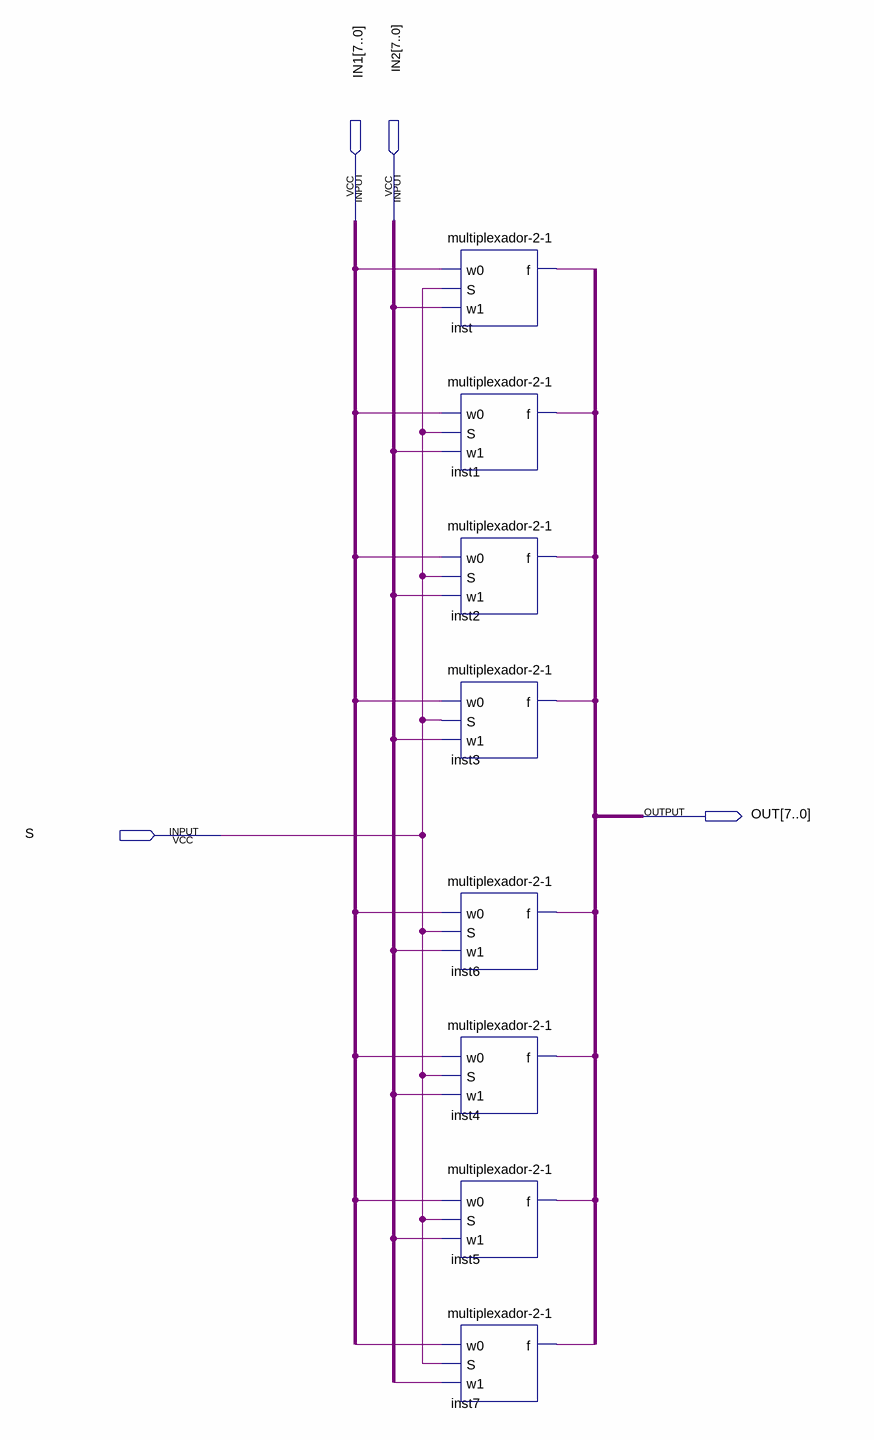
[diagram p0: schematic sheet]
// Quartus schematic multiplexador-16-8.bdf as structural Verilog: 8 symbols, 4 pins
module \multiplexador-16-8  (
  input  [7:0] IN1,
  input  [7:0] IN2,
  input  S,
  output [7:0] OUT
);

  wire inst1_f, inst2_f, inst3_f, inst4_f, inst5_f, inst6_f, inst7_f, inst_f, undriven, undriven_2,
       undriven_3, undriven_4, undriven_5, undriven_6, undriven_7, undriven_8, undriven_9, undriven_10,
       undriven_11, undriven_12, undriven_13, undriven_14, undriven_15, undriven_16;

  \multiplexador-2-1  inst (.w0(undriven), .S(S), .w1(undriven_2), .f(inst_f));
  \multiplexador-2-1  inst1 (.w0(undriven_4), .S(S), .w1(undriven_3), .f(inst1_f));
  \multiplexador-2-1  inst2 (.w0(undriven_5), .S(S), .w1(undriven_6), .f(inst2_f));
  \multiplexador-2-1  inst3 (.w0(undriven_7), .S(S), .w1(undriven_8), .f(inst3_f));
  \multiplexador-2-1  inst6 (.w0(undriven_9), .S(S), .w1(undriven_10), .f(inst6_f));
  \multiplexador-2-1  inst4 (.w0(undriven_11), .S(S), .w1(undriven_12), .f(inst4_f));
  \multiplexador-2-1  inst5 (.w0(undriven_14), .S(S), .w1(undriven_13), .f(inst5_f));
  \multiplexador-2-1  inst7 (.w0(undriven_15), .S(S), .w1(undriven_16), .f(inst7_f));
endmodule
